# Altium schematic sheet LPCB235 - SPI UART - GROUP B.SchDoc
size A3; Address1: Factory 10; Address2: 9-13 Dingley Avenue, Dandeong, VICTORIA 3175, AUSTRALIA; DocumentNumber: 34; Revision: 1; SheetNumber: 34; SheetTotal: 37; Lockie__PCB_SUB_ASSEMBLY: SPI UARTS B; Lockie__PCB_ASSEMBLY: FCU PCB; Lockie__LDL: LPCB235; Lockie__PCB_DESCRIPTION: Flight Control Unit
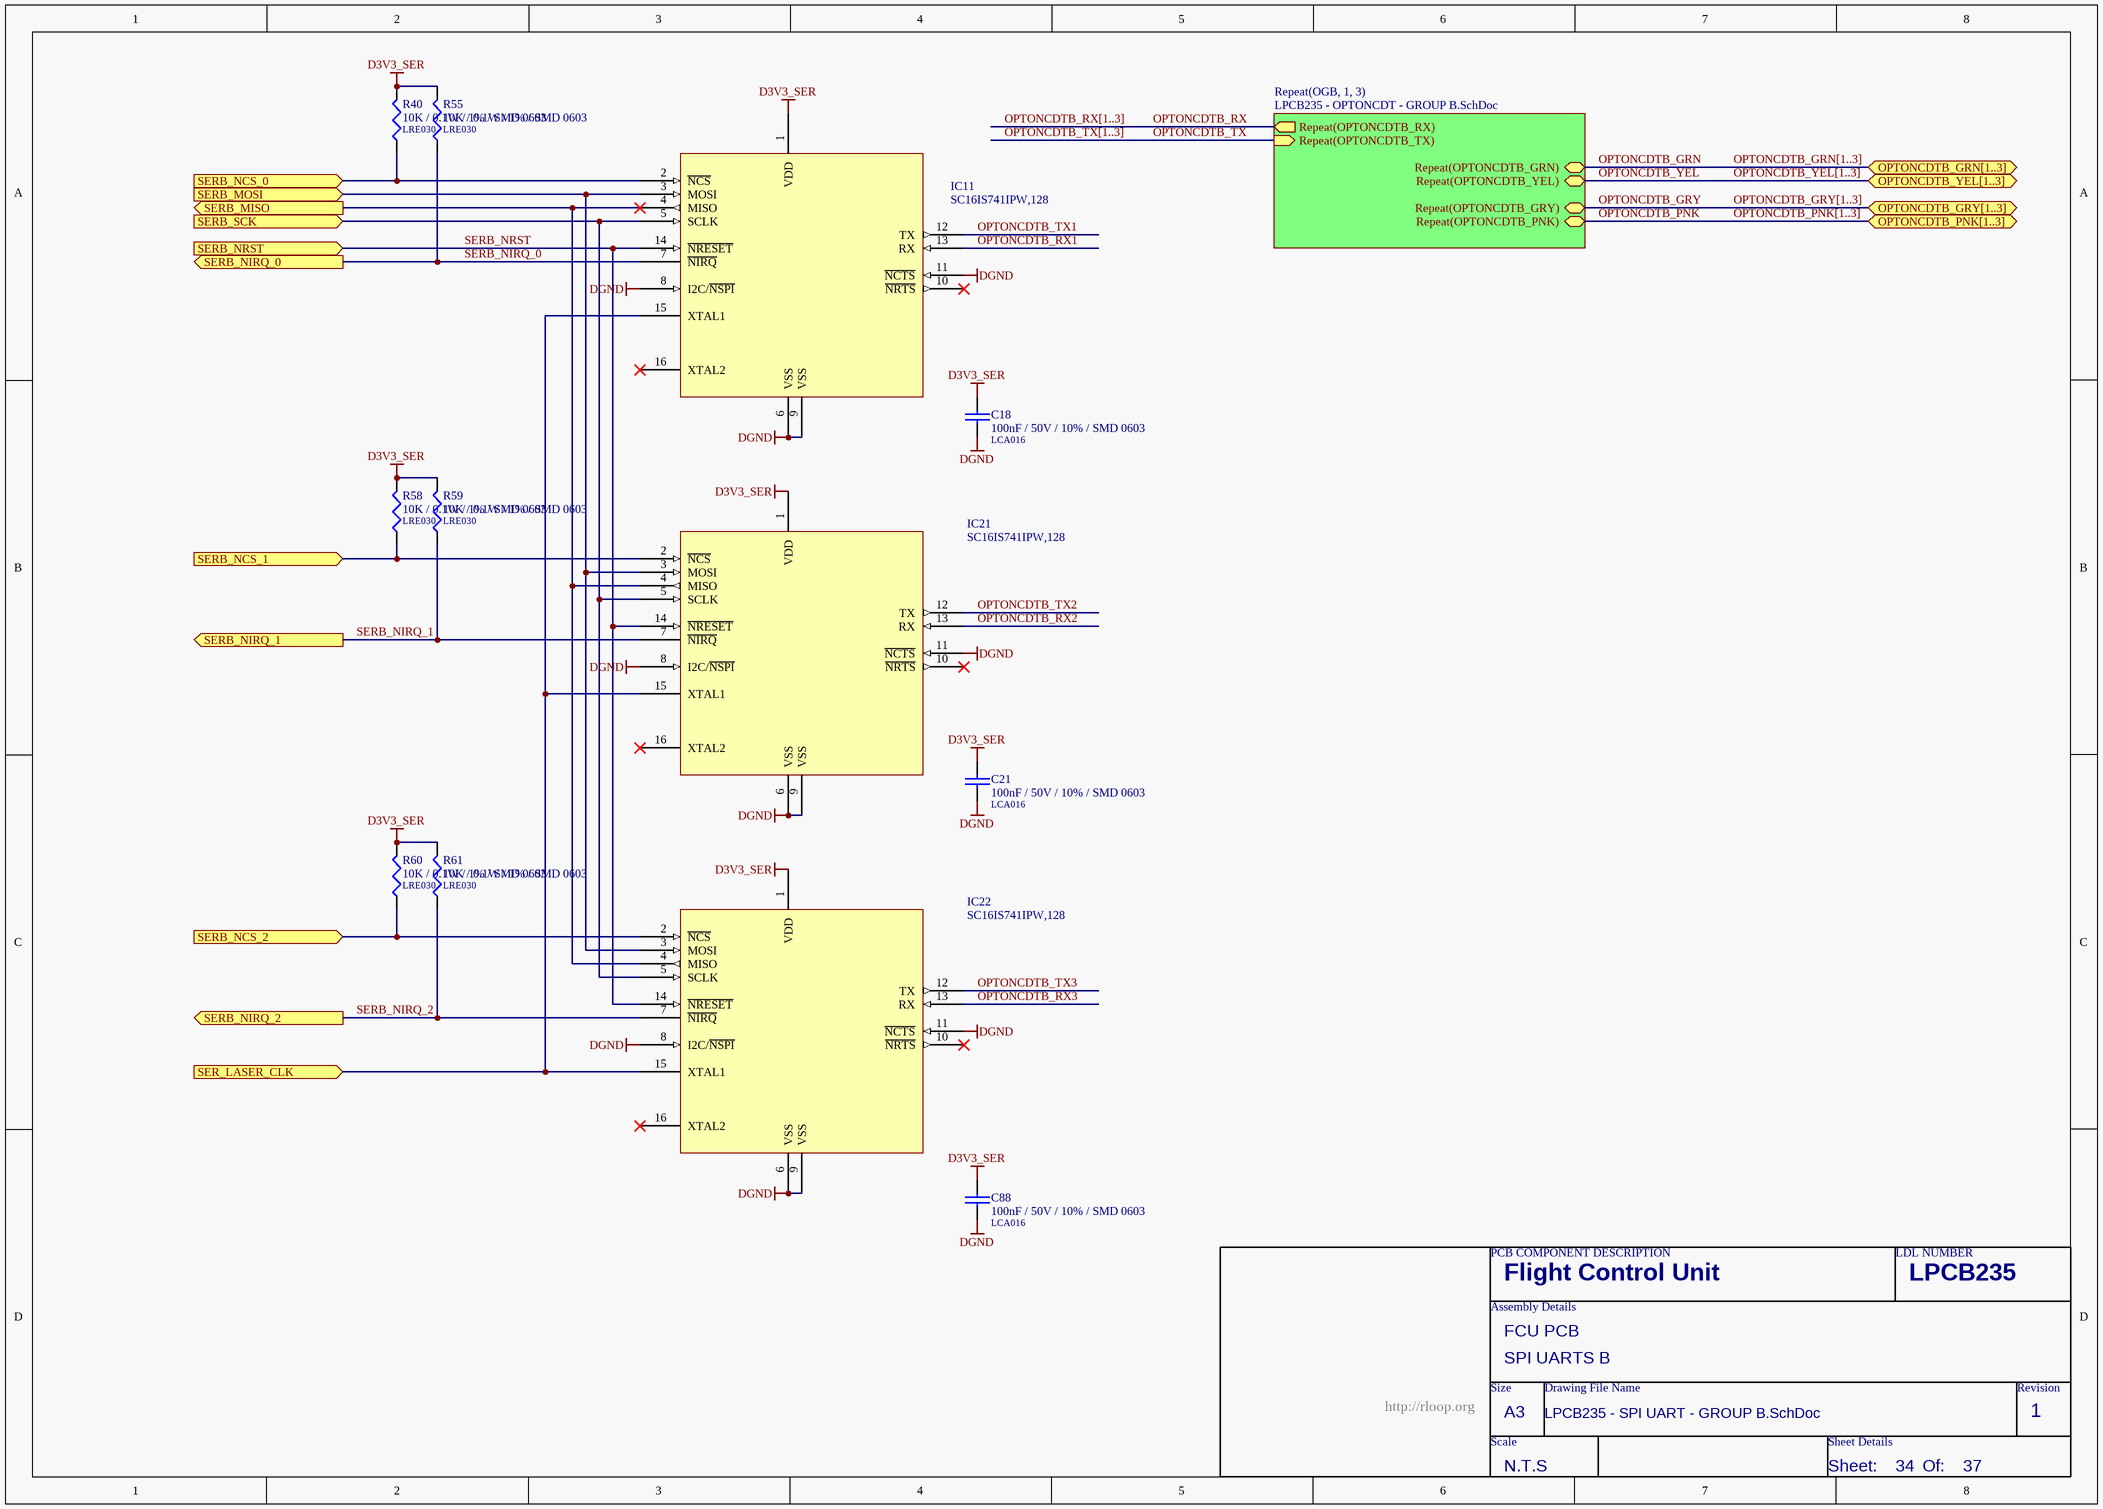
[diagram p0: LPCB235 - SPI UART - GROUP B.SchDoc]

## Parts
C18  100nF / 50V / 10% / SMD 0603  LDL_NUMBER: LCA016  [LFP011__CC1608-0603-IPC7351_B]
C21  100nF / 50V / 10% / SMD 0603  LDL_NUMBER: LCA016  [LFP011__CC1608-0603-IPC7351_B]
C88  100nF / 50V / 10% / SMD 0603  LDL_NUMBER: LCA016  [LFP011__CC1608-0603-IPC7351_B]
IC11  SC16IS741IPW,128  [LFP049__TSSOP-16]
IC21  SC16IS741IPW,128  [LFP049__TSSOP-16]
IC22  SC16IS741IPW,128  [LFP049__TSSOP-16]
R40  10K / 0.1W / 1% / SMD 0603  LDL_NUMBER: LRE030  [LFP020__CR1608-0603-IPC7351_B]
R55  10K / 0.1W / 1% / SMD 0603  LDL_NUMBER: LRE030  [LFP020__CR1608-0603-IPC7351_B]
R58  10K / 0.1W / 1% / SMD 0603  LDL_NUMBER: LRE030  [LFP020__CR1608-0603-IPC7351_B]
R59  10K / 0.1W / 1% / SMD 0603  LDL_NUMBER: LRE030  [LFP020__CR1608-0603-IPC7351_B]
R60  10K / 0.1W / 1% / SMD 0603  LDL_NUMBER: LRE030  [LFP020__CR1608-0603-IPC7351_B]
R61  10K / 0.1W / 1% / SMD 0603  LDL_NUMBER: LRE030  [LFP020__CR1608-0603-IPC7351_B]

## Sub-sheets
Repeat(OGB, 1, 3) = LPCB235 - OPTONCDT - GROUP B.SchDoc: Repeat(OPTONCDTB_GRN) (bidir), Repeat(OPTONCDTB_YEL) (bidir), Repeat(OPTONCDTB_GRY) (bidir), Repeat(OPTONCDTB_PNK) (bidir), Repeat(OPTONCDTB_RX) (out), Repeat(OPTONCDTB_TX) (in)

## Ports
OPTONCDTB_GRN[1..3] (bidir), OPTONCDTB_GRY[1..3] (bidir), OPTONCDTB_PNK[1..3] (bidir), OPTONCDTB_YEL[1..3] (bidir), SER_LASER_CLK (in), SERB_MISO (out), SERB_MOSI (in), SERB_NCS_0 (in), SERB_NCS_1 (in), SERB_NCS_2 (in), SERB_NIRQ_0 (out), SERB_NIRQ_1 (out), SERB_NIRQ_2 (out), SERB_NRST (in), SERB_SCK (in)

## Nets
D3V3_SER: C18.1 C21.1 C88.1 IC11.1(VDD) IC21.1(VDD) IC22.1(VDD) R40.2 R55.2 R58.2 R59.2 R60.2 R61.2
DGND: C18.2 C21.2 C88.2 IC11.6(VSS) IC11.8(I2C/~{NSPI}) IC11.9(VSS) IC11.11(~{NCTS}) IC21.6(VSS) IC21.8(I2C/~{NSPI}) IC21.9(VSS) IC21.11(~{NCTS}) IC22.6(VSS) IC22.8(I2C/~{NSPI}) IC22.9(VSS) IC22.11(~{NCTS})
OPTONCDTB_GRN: sheet Repeat(OGB, 1, 3)/Repeat(OPTONCDTB_GRN)
OPTONCDTB_GRY: sheet Repeat(OGB, 1, 3)/Repeat(OPTONCDTB_GRY)
OPTONCDTB_PNK: sheet Repeat(OGB, 1, 3)/Repeat(OPTONCDTB_PNK)
OPTONCDTB_RX: sheet Repeat(OGB, 1, 3)/Repeat(OPTONCDTB_RX)
OPTONCDTB_RX1: IC11.13(RX)
OPTONCDTB_RX2: IC21.13(RX)
OPTONCDTB_RX3: IC22.13(RX)
OPTONCDTB_TX: sheet Repeat(OGB, 1, 3)/Repeat(OPTONCDTB_TX)
OPTONCDTB_TX1: IC11.12(TX)
OPTONCDTB_TX2: IC21.12(TX)
OPTONCDTB_TX3: IC22.12(TX)
OPTONCDTB_YEL: sheet Repeat(OGB, 1, 3)/Repeat(OPTONCDTB_YEL)
SER_LASER_CLK: IC11.15(XTAL1) IC21.15(XTAL1) IC22.15(XTAL1) ; port SER_LASER_CLK
SERB_MISO: IC11.4(MISO) IC21.4(MISO) IC22.4(MISO) ; port SERB_MISO
SERB_MOSI: IC11.3(MOSI) IC21.3(MOSI) IC22.3(MOSI) ; port SERB_MOSI
SERB_NCS_0: IC11.2(~{NCS}) R40.1 ; port SERB_NCS_0
SERB_NCS_1: IC21.2(~{NCS}) R58.1 ; port SERB_NCS_1
SERB_NCS_2: IC22.2(~{NCS}) R60.1 ; port SERB_NCS_2
SERB_NIRQ_0: IC11.7(~{NIRQ}) R55.1 ; port SERB_NIRQ_0
SERB_NIRQ_1: IC21.7(~{NIRQ}) R59.1 ; port SERB_NIRQ_1
SERB_NIRQ_2: IC22.7(~{NIRQ}) R61.1 ; port SERB_NIRQ_2
SERB_NRST: IC11.14(~{NRESET}) IC21.14(~{NRESET}) IC22.14(~{NRESET}) ; port SERB_NRST
SERB_SCK: IC11.5(SCLK) IC21.5(SCLK) IC22.5(SCLK) ; port SERB_SCK

Not connected (* = marked no-connect by the designer): IC11 10(~{NRTS})* 16(XTAL2)*; IC21 10(~{NRTS})* 16(XTAL2)*; IC22 10(~{NRTS})* 16(XTAL2)*

## Buses and harness runs
bus OPTONCDTB_GRN[1..3] = port OPTONCDTB_GRN[1..3]
bus OPTONCDTB_GRY[1..3] = port OPTONCDTB_GRY[1..3]
bus OPTONCDTB_PNK[1..3] = port OPTONCDTB_PNK[1..3]
bus OPTONCDTB_RX[1..3]
bus OPTONCDTB_TX[1..3]
bus OPTONCDTB_YEL[1..3] = port OPTONCDTB_YEL[1..3]

## Notes on the sheet
- PCB COMPONENT DESCRIPTION
- LDL NUMBER
- Assembly Details
- Size
- Drawing File Name
- Revision
- http://rloop.org
- Scale
- A3
- Sheet Details
- N.T.S
- Sheet:
- Of:

## Library data of the parts
C18 C21 C88 = 100nF / 50V / 10% / SMD 0603: Capacitor, Ceramic Chip, 100nF (0.1uF), 50V, 5%, SMD 0603 [LCA016]; Value: 100n; FMEDA__OPERATING__VOLTAGE_MIN: 0; FMEDA__OPERATING__VOLTAGE_MAX: 3.3; FMEDA__OPERATING__TEMP_MIN: -20; FMEDA__OPERATING__TEMP_TYP: 27; FMEDA__OPERATING__TEMP_MAX: 50; FMEDA__CHANNEL: COM; FMEDA__FUNCTION_IN_SYSTEM: *; FMEDA__OPERATING__VOLTAGE_TYP: 3.3
IC11 IC21 IC22 = SC16IS741IPW,128: IC, SPI to UART bridge [LIC472]; FMEDA__CHANNEL: COM; LDL_NUMBER: LIC472; FMEDA__FUNCTION_IN_SYSTEM: *
R40 R55 R58-R61 = 10K / 0.1W / 1% / SMD 0603: Resistor, Ceramic Chip, 10K, 0.1W, 1%, SMD 0603 [LRE030]; FMEDA__OPERATING__POWER_MAX: 0; FMEDA__OPERATING__TEMP_MAX: 50; FMEDA__OPERATING__TEMP_MIN: -20; FMEDA__OPERATING__TEMP_TYP: 27; FMEDA__CHANNEL: COM; Value: 10K; FMEDA__OPERATING__POWER_MIN: 0; FMEDA__OPERATING__VOLTAGE_MAX: 0; FMEDA__OPERATING__VOLTAGE_MIN: 0; FMEDA__OPERATING__VOLTAGE_TYP: 0; FMEDA__FUNCTION_IN_SYSTEM: *